# EAGLE design Temp_SMD (EAGLE 8.0.0)
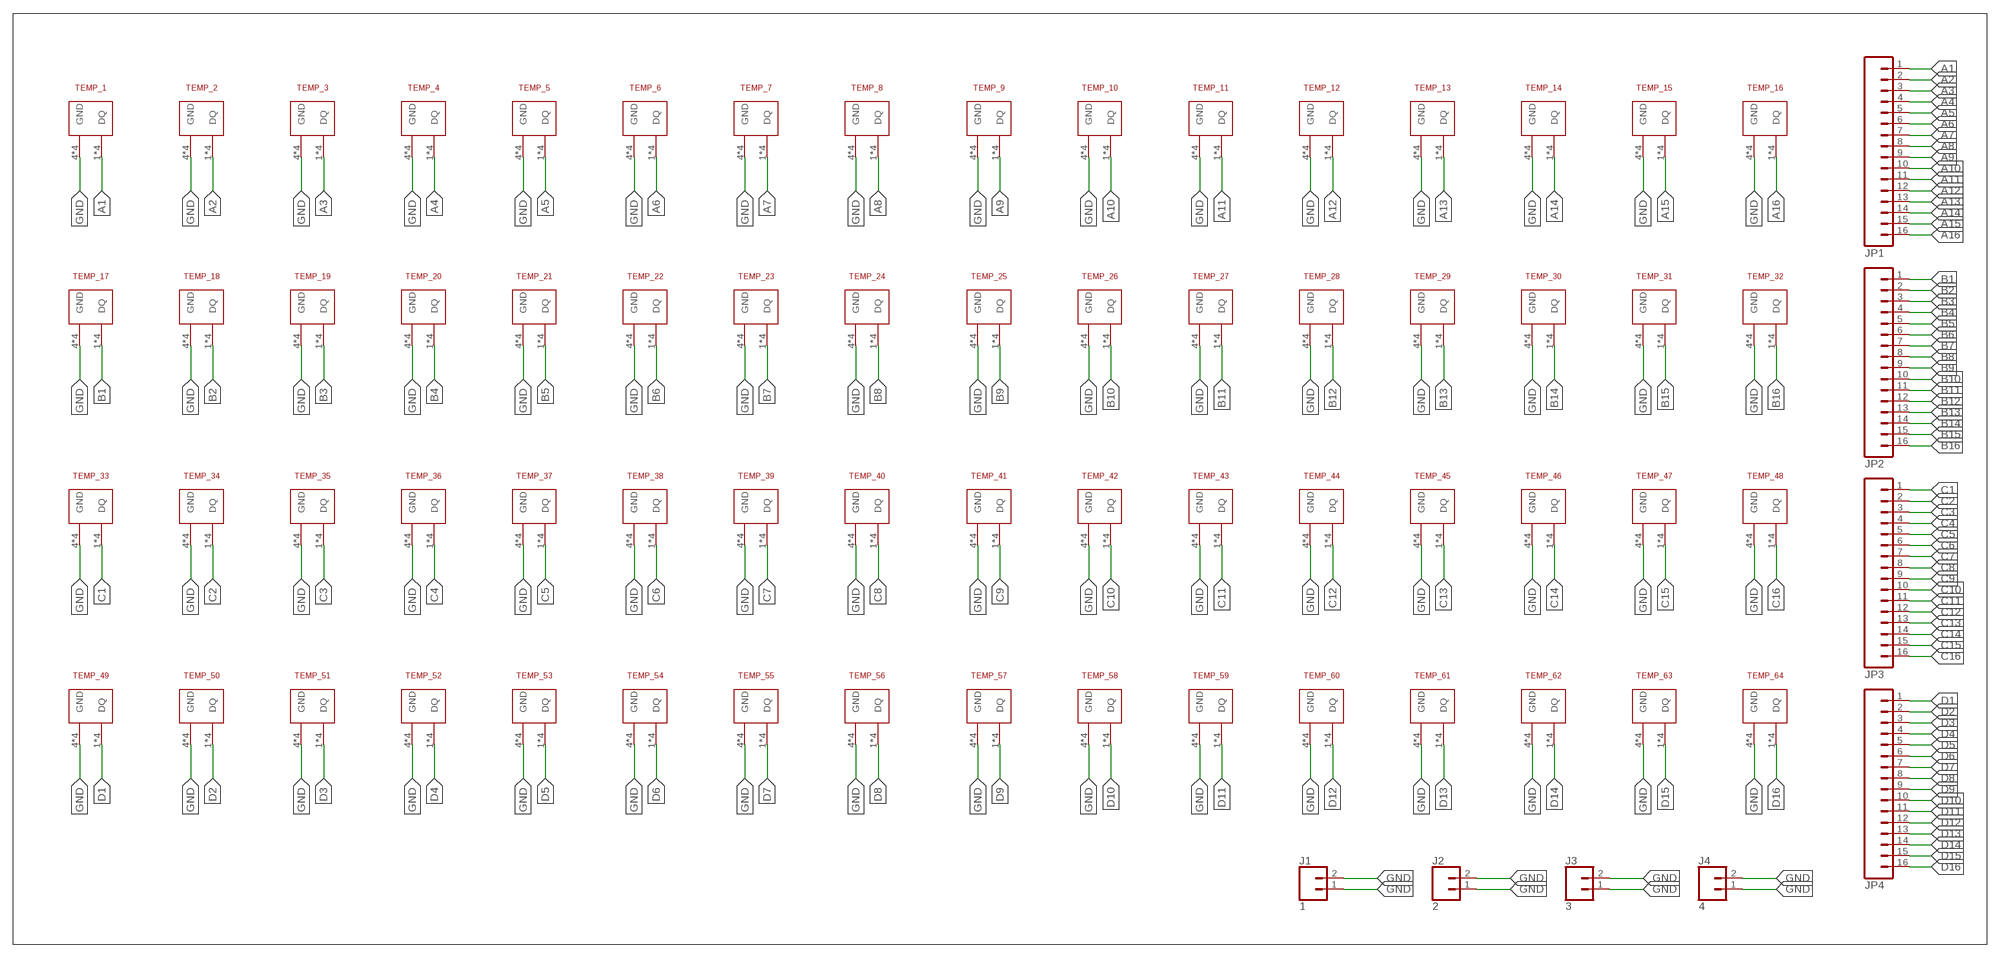
[diagram p0: schematic, sheet 1]

## Parts
J1  1  CONN_02  [1X02]
J2  2  CONN_02  [1X02]
J3  3  CONN_02  [1X02]
J4  4  CONN_02  [1X02]
JP1  M16PTH  [1X16]
JP2  M16PTH  [1X16]
JP3  M16PTH  [1X16]
JP4  M16PTH  [1X16]
TEMP_1  SMD_TEMP  [SMD_TEMP]
TEMP_2  SMD_TEMP  [SMD_TEMP]
TEMP_3  SMD_TEMP  [SMD_TEMP]
TEMP_4  SMD_TEMP  [SMD_TEMP]
TEMP_5  SMD_TEMP  [SMD_TEMP]
TEMP_6  SMD_TEMP  [SMD_TEMP]
TEMP_7  SMD_TEMP  [SMD_TEMP]
TEMP_8  SMD_TEMP  [SMD_TEMP]
TEMP_9  SMD_TEMP  [SMD_TEMP]
TEMP_10  SMD_TEMP  [SMD_TEMP]
TEMP_11  SMD_TEMP  [SMD_TEMP]
TEMP_12  SMD_TEMP  [SMD_TEMP]
TEMP_13  SMD_TEMP  [SMD_TEMP]
TEMP_14  SMD_TEMP  [SMD_TEMP]
TEMP_15  SMD_TEMP  [SMD_TEMP]
TEMP_16  SMD_TEMP  [SMD_TEMP]
TEMP_17  SMD_TEMP  [SMD_TEMP]
TEMP_18  SMD_TEMP  [SMD_TEMP]
TEMP_19  SMD_TEMP  [SMD_TEMP]
TEMP_20  SMD_TEMP  [SMD_TEMP]
TEMP_21  SMD_TEMP  [SMD_TEMP]
TEMP_22  SMD_TEMP  [SMD_TEMP]
TEMP_23  SMD_TEMP  [SMD_TEMP]
TEMP_24  SMD_TEMP  [SMD_TEMP]
TEMP_25  SMD_TEMP  [SMD_TEMP]
TEMP_26  SMD_TEMP  [SMD_TEMP]
TEMP_27  SMD_TEMP  [SMD_TEMP]
TEMP_28  SMD_TEMP  [SMD_TEMP]
TEMP_29  SMD_TEMP  [SMD_TEMP]
TEMP_30  SMD_TEMP  [SMD_TEMP]
TEMP_31  SMD_TEMP  [SMD_TEMP]
TEMP_32  SMD_TEMP  [SMD_TEMP]
TEMP_33  SMD_TEMP  [SMD_TEMP]
TEMP_34  SMD_TEMP  [SMD_TEMP]
TEMP_35  SMD_TEMP  [SMD_TEMP]
TEMP_36  SMD_TEMP  [SMD_TEMP]
TEMP_37  SMD_TEMP  [SMD_TEMP]
TEMP_38  SMD_TEMP  [SMD_TEMP]
TEMP_39  SMD_TEMP  [SMD_TEMP]
TEMP_40  SMD_TEMP  [SMD_TEMP]
TEMP_41  SMD_TEMP  [SMD_TEMP]
TEMP_42  SMD_TEMP  [SMD_TEMP]
TEMP_43  SMD_TEMP  [SMD_TEMP]
TEMP_44  SMD_TEMP  [SMD_TEMP]
TEMP_45  SMD_TEMP  [SMD_TEMP]
TEMP_46  SMD_TEMP  [SMD_TEMP]
TEMP_47  SMD_TEMP  [SMD_TEMP]
TEMP_48  SMD_TEMP  [SMD_TEMP]
TEMP_49  SMD_TEMP  [SMD_TEMP]
TEMP_50  SMD_TEMP  [SMD_TEMP]
TEMP_51  SMD_TEMP  [SMD_TEMP]
TEMP_52  SMD_TEMP  [SMD_TEMP]
TEMP_53  SMD_TEMP  [SMD_TEMP]
TEMP_54  SMD_TEMP  [SMD_TEMP]
TEMP_55  SMD_TEMP  [SMD_TEMP]
TEMP_56  SMD_TEMP  [SMD_TEMP]
TEMP_57  SMD_TEMP  [SMD_TEMP]
TEMP_58  SMD_TEMP  [SMD_TEMP]
TEMP_59  SMD_TEMP  [SMD_TEMP]
TEMP_60  SMD_TEMP  [SMD_TEMP]
TEMP_61  SMD_TEMP  [SMD_TEMP]
TEMP_62  SMD_TEMP  [SMD_TEMP]
TEMP_63  SMD_TEMP  [SMD_TEMP]
TEMP_64  SMD_TEMP  [SMD_TEMP]

## Nets
A1: JP1.1 TEMP_1.1(DQ) TEMP_1.DQ TEMP_1.DQ1(DQ) TEMP_1.DQ2(DQ)
A2: JP1.2 TEMP_2.1(DQ) TEMP_2.DQ TEMP_2.DQ1(DQ) TEMP_2.DQ2(DQ)
A3: JP1.3 TEMP_3.1(DQ) TEMP_3.DQ TEMP_3.DQ1(DQ) TEMP_3.DQ2(DQ)
A4: JP1.4 TEMP_4.1(DQ) TEMP_4.DQ TEMP_4.DQ1(DQ) TEMP_4.DQ2(DQ)
A5: JP1.5 TEMP_5.1(DQ) TEMP_5.DQ TEMP_5.DQ1(DQ) TEMP_5.DQ2(DQ)
A6: JP1.6 TEMP_6.1(DQ) TEMP_6.DQ TEMP_6.DQ1(DQ) TEMP_6.DQ2(DQ)
A7: JP1.7 TEMP_7.1(DQ) TEMP_7.DQ TEMP_7.DQ1(DQ) TEMP_7.DQ2(DQ)
A8: JP1.8 TEMP_8.1(DQ) TEMP_8.DQ TEMP_8.DQ1(DQ) TEMP_8.DQ2(DQ)
A9: JP1.9 TEMP_9.1(DQ) TEMP_9.DQ TEMP_9.DQ1(DQ) TEMP_9.DQ2(DQ)
A10: JP1.10 TEMP_10.1(DQ) TEMP_10.DQ TEMP_10.DQ1(DQ) TEMP_10.DQ2(DQ)
A11: JP1.11 TEMP_11.1(DQ) TEMP_11.DQ TEMP_11.DQ1(DQ) TEMP_11.DQ2(DQ)
A12: JP1.12 TEMP_12.1(DQ) TEMP_12.DQ TEMP_12.DQ1(DQ) TEMP_12.DQ2(DQ)
A13: JP1.13 TEMP_13.1(DQ) TEMP_13.DQ TEMP_13.DQ1(DQ) TEMP_13.DQ2(DQ)
A14: JP1.14 TEMP_14.1(DQ) TEMP_14.DQ TEMP_14.DQ1(DQ) TEMP_14.DQ2(DQ)
A15: JP1.15 TEMP_15.1(DQ) TEMP_15.DQ TEMP_15.DQ1(DQ) TEMP_15.DQ2(DQ)
A16: JP1.16 TEMP_16.1(DQ) TEMP_16.DQ TEMP_16.DQ1(DQ) TEMP_16.DQ2(DQ)
B1: JP2.1 TEMP_17.1(DQ) TEMP_17.DQ TEMP_17.DQ1(DQ) TEMP_17.DQ2(DQ)
B2: JP2.2 TEMP_18.1(DQ) TEMP_18.DQ TEMP_18.DQ1(DQ) TEMP_18.DQ2(DQ)
B3: JP2.3 TEMP_19.1(DQ) TEMP_19.DQ TEMP_19.DQ1(DQ) TEMP_19.DQ2(DQ)
B4: JP2.4 TEMP_20.1(DQ) TEMP_20.DQ TEMP_20.DQ1(DQ) TEMP_20.DQ2(DQ)
B5: JP2.5 TEMP_21.1(DQ) TEMP_21.DQ TEMP_21.DQ1(DQ) TEMP_21.DQ2(DQ)
B6: JP2.6 TEMP_22.1(DQ) TEMP_22.DQ TEMP_22.DQ1(DQ) TEMP_22.DQ2(DQ)
B7: JP2.7 TEMP_23.1(DQ) TEMP_23.DQ TEMP_23.DQ1(DQ) TEMP_23.DQ2(DQ)
B8: JP2.8 TEMP_24.1(DQ) TEMP_24.DQ TEMP_24.DQ1(DQ) TEMP_24.DQ2(DQ)
B9: JP2.9 TEMP_25.1(DQ) TEMP_25.DQ TEMP_25.DQ1(DQ) TEMP_25.DQ2(DQ)
B10: JP2.10 TEMP_26.1(DQ) TEMP_26.DQ TEMP_26.DQ1(DQ) TEMP_26.DQ2(DQ)
B11: JP2.11 TEMP_27.1(DQ) TEMP_27.DQ TEMP_27.DQ1(DQ) TEMP_27.DQ2(DQ)
B12: JP2.12 TEMP_28.1(DQ) TEMP_28.DQ TEMP_28.DQ1(DQ) TEMP_28.DQ2(DQ)
B13: JP2.13 TEMP_29.1(DQ) TEMP_29.DQ TEMP_29.DQ1(DQ) TEMP_29.DQ2(DQ)
B14: JP2.14 TEMP_30.1(DQ) TEMP_30.DQ TEMP_30.DQ1(DQ) TEMP_30.DQ2(DQ)
B15: JP2.15 TEMP_31.1(DQ) TEMP_31.DQ TEMP_31.DQ1(DQ) TEMP_31.DQ2(DQ)
B16: JP2.16 TEMP_32.1(DQ) TEMP_32.DQ TEMP_32.DQ1(DQ) TEMP_32.DQ2(DQ)
C1: JP3.1 TEMP_33.1(DQ) TEMP_33.DQ TEMP_33.DQ1(DQ) TEMP_33.DQ2(DQ)
C2: JP3.2 TEMP_34.1(DQ) TEMP_34.DQ TEMP_34.DQ1(DQ) TEMP_34.DQ2(DQ)
C3: JP3.3 TEMP_35.1(DQ) TEMP_35.DQ TEMP_35.DQ1(DQ) TEMP_35.DQ2(DQ)
C4: JP3.4 TEMP_36.1(DQ) TEMP_36.DQ TEMP_36.DQ1(DQ) TEMP_36.DQ2(DQ)
C5: JP3.5 TEMP_37.1(DQ) TEMP_37.DQ TEMP_37.DQ1(DQ) TEMP_37.DQ2(DQ)
C6: JP3.6 TEMP_38.1(DQ) TEMP_38.DQ TEMP_38.DQ1(DQ) TEMP_38.DQ2(DQ)
C7: JP3.7 TEMP_39.1(DQ) TEMP_39.DQ TEMP_39.DQ1(DQ) TEMP_39.DQ2(DQ)
C8: JP3.8 TEMP_40.1(DQ) TEMP_40.DQ TEMP_40.DQ1(DQ) TEMP_40.DQ2(DQ)
C9: JP3.9 TEMP_41.1(DQ) TEMP_41.DQ TEMP_41.DQ1(DQ) TEMP_41.DQ2(DQ)
C10: JP3.10 TEMP_42.1(DQ) TEMP_42.DQ TEMP_42.DQ1(DQ) TEMP_42.DQ2(DQ)
C11: JP3.11 TEMP_43.1(DQ) TEMP_43.DQ TEMP_43.DQ1(DQ) TEMP_43.DQ2(DQ)
C12: JP3.12 TEMP_44.1(DQ) TEMP_44.DQ TEMP_44.DQ1(DQ) TEMP_44.DQ2(DQ)
C13: JP3.13 TEMP_45.1(DQ) TEMP_45.DQ TEMP_45.DQ1(DQ) TEMP_45.DQ2(DQ)
C14: JP3.14 TEMP_46.1(DQ) TEMP_46.DQ TEMP_46.DQ1(DQ) TEMP_46.DQ2(DQ)
C15: JP3.15 TEMP_47.1(DQ) TEMP_47.DQ TEMP_47.DQ1(DQ) TEMP_47.DQ2(DQ)
C16: JP3.16 TEMP_48.1(DQ) TEMP_48.DQ TEMP_48.DQ1(DQ) TEMP_48.DQ2(DQ)
D1: JP4.1 TEMP_49.1(DQ) TEMP_49.DQ TEMP_49.DQ1(DQ) TEMP_49.DQ2(DQ)
D2: JP4.2 TEMP_50.1(DQ) TEMP_50.DQ TEMP_50.DQ1(DQ) TEMP_50.DQ2(DQ)
D3: JP4.3 TEMP_51.1(DQ) TEMP_51.DQ TEMP_51.DQ1(DQ) TEMP_51.DQ2(DQ)
D4: JP4.4 TEMP_52.1(DQ) TEMP_52.DQ TEMP_52.DQ1(DQ) TEMP_52.DQ2(DQ)
D5: JP4.5 TEMP_53.1(DQ) TEMP_53.DQ TEMP_53.DQ1(DQ) TEMP_53.DQ2(DQ)
D6: JP4.6 TEMP_54.1(DQ) TEMP_54.DQ TEMP_54.DQ1(DQ) TEMP_54.DQ2(DQ)
D7: JP4.7 TEMP_55.1(DQ) TEMP_55.DQ TEMP_55.DQ1(DQ) TEMP_55.DQ2(DQ)
D8: JP4.8 TEMP_56.1(DQ) TEMP_56.DQ TEMP_56.DQ1(DQ) TEMP_56.DQ2(DQ)
D9: JP4.9 TEMP_57.1(DQ) TEMP_57.DQ TEMP_57.DQ1(DQ) TEMP_57.DQ2(DQ)
D10: JP4.10 TEMP_58.1(DQ) TEMP_58.DQ TEMP_58.DQ1(DQ) TEMP_58.DQ2(DQ)
D11: JP4.11 TEMP_59.1(DQ) TEMP_59.DQ TEMP_59.DQ1(DQ) TEMP_59.DQ2(DQ)
D12: JP4.12 TEMP_60.1(DQ) TEMP_60.DQ TEMP_60.DQ1(DQ) TEMP_60.DQ2(DQ)
D13: JP4.13 TEMP_61.1(DQ) TEMP_61.DQ TEMP_61.DQ1(DQ) TEMP_61.DQ2(DQ)
D14: JP4.14 TEMP_62.1(DQ) TEMP_62.DQ TEMP_62.DQ1(DQ) TEMP_62.DQ2(DQ)
D15: JP4.15 TEMP_63.1(DQ) TEMP_63.DQ TEMP_63.DQ1(DQ) TEMP_63.DQ2(DQ)
D16: JP4.16 TEMP_64.1(DQ) TEMP_64.DQ TEMP_64.DQ1(DQ) TEMP_64.DQ2(DQ)
GND: J1.1 J1.2 J2.1 J2.2 J3.1 J3.2 J4.1 J4.2 TEMP_1.4(GND) TEMP_1.8(GND) TEMP_1.GND1(GND) TEMP_1.GND2(GND) TEMP_2.4(GND) TEMP_2.8(GND) TEMP_2.GND1(GND) TEMP_2.GND2(GND) TEMP_3.4(GND) TEMP_3.8(GND) TEMP_3.GND1(GND) TEMP_3.GND2(GND) TEMP_4.4(GND) TEMP_4.8(GND) TEMP_4.GND1(GND) TEMP_4.GND2(GND) TEMP_5.4(GND) TEMP_5.8(GND) TEMP_5.GND1(GND) TEMP_5.GND2(GND) TEMP_6.4(GND) TEMP_6.8(GND) TEMP_6.GND1(GND) TEMP_6.GND2(GND) TEMP_7.4(GND) TEMP_7.8(GND) TEMP_7.GND1(GND) TEMP_7.GND2(GND) TEMP_8.4(GND) TEMP_8.8(GND) TEMP_8.GND1(GND) TEMP_8.GND2(GND) TEMP_9.4(GND) TEMP_9.8(GND) TEMP_9.GND1(GND) TEMP_9.GND2(GND) TEMP_10.4(GND) TEMP_10.8(GND) TEMP_10.GND1(GND) TEMP_10.GND2(GND) TEMP_11.4(GND) TEMP_11.8(GND) TEMP_11.GND1(GND) TEMP_11.GND2(GND) TEMP_12.4(GND) TEMP_12.8(GND) TEMP_12.GND1(GND) TEMP_12.GND2(GND) TEMP_13.4(GND) TEMP_13.8(GND) TEMP_13.GND1(GND) TEMP_13.GND2(GND) TEMP_14.4(GND) TEMP_14.8(GND) TEMP_14.GND1(GND) TEMP_14.GND2(GND) TEMP_15.4(GND) TEMP_15.8(GND) TEMP_15.GND1(GND) TEMP_15.GND2(GND) TEMP_16.4(GND) TEMP_16.8(GND) TEMP_16.GND1(GND) TEMP_16.GND2(GND) TEMP_17.4(GND) TEMP_17.8(GND) TEMP_17.GND1(GND) TEMP_17.GND2(GND) TEMP_18.4(GND) TEMP_18.8(GND) TEMP_18.GND1(GND) TEMP_18.GND2(GND) TEMP_19.4(GND) TEMP_19.8(GND) TEMP_19.GND1(GND) TEMP_19.GND2(GND) TEMP_20.4(GND) TEMP_20.8(GND) TEMP_20.GND1(GND) TEMP_20.GND2(GND) TEMP_21.4(GND) TEMP_21.8(GND) TEMP_21.GND1(GND) TEMP_21.GND2(GND) TEMP_22.4(GND) TEMP_22.8(GND) TEMP_22.GND1(GND) TEMP_22.GND2(GND) TEMP_23.4(GND) TEMP_23.8(GND) TEMP_23.GND1(GND) TEMP_23.GND2(GND) TEMP_24.4(GND) TEMP_24.8(GND) TEMP_24.GND1(GND) TEMP_24.GND2(GND) TEMP_25.4(GND) TEMP_25.8(GND) TEMP_25.GND1(GND) TEMP_25.GND2(GND) TEMP_26.4(GND) TEMP_26.8(GND) TEMP_26.GND1(GND) TEMP_26.GND2(GND) TEMP_27.4(GND) TEMP_27.8(GND) TEMP_27.GND1(GND) TEMP_27.GND2(GND) TEMP_28.4(GND) TEMP_28.8(GND) TEMP_28.GND1(GND) TEMP_28.GND2(GND) TEMP_29.4(GND) TEMP_29.8(GND) TEMP_29.GND1(GND) TEMP_29.GND2(GND) TEMP_30.4(GND) TEMP_30.8(GND) TEMP_30.GND1(GND) TEMP_30.GND2(GND) TEMP_31.4(GND) TEMP_31.8(GND) TEMP_31.GND1(GND) TEMP_31.GND2(GND) TEMP_32.4(GND) TEMP_32.8(GND) TEMP_32.GND1(GND) TEMP_32.GND2(GND) TEMP_33.4(GND) TEMP_33.8(GND) TEMP_33.GND1(GND) TEMP_33.GND2(GND) TEMP_34.4(GND) TEMP_34.8(GND) TEMP_34.GND1(GND) TEMP_34.GND2(GND) TEMP_35.4(GND) TEMP_35.8(GND) TEMP_35.GND1(GND) TEMP_35.GND2(GND) TEMP_36.4(GND) TEMP_36.8(GND) TEMP_36.GND1(GND) TEMP_36.GND2(GND) TEMP_37.4(GND) TEMP_37.8(GND) TEMP_37.GND1(GND) TEMP_37.GND2(GND) TEMP_38.4(GND) TEMP_38.8(GND) TEMP_38.GND1(GND) TEMP_38.GND2(GND) TEMP_39.4(GND) TEMP_39.8(GND) TEMP_39.GND1(GND) TEMP_39.GND2(GND) TEMP_40.4(GND) TEMP_40.8(GND) TEMP_40.GND1(GND) TEMP_40.GND2(GND) TEMP_41.4(GND) TEMP_41.8(GND) TEMP_41.GND1(GND) TEMP_41.GND2(GND) TEMP_42.4(GND) TEMP_42.8(GND) TEMP_42.GND1(GND) TEMP_42.GND2(GND) TEMP_43.4(GND) TEMP_43.8(GND) TEMP_43.GND1(GND) TEMP_43.GND2(GND) TEMP_44.4(GND) TEMP_44.8(GND) TEMP_44.GND1(GND) TEMP_44.GND2(GND) TEMP_45.4(GND) TEMP_45.8(GND) TEMP_45.GND1(GND) TEMP_45.GND2(GND) TEMP_46.4(GND) TEMP_46.8(GND) TEMP_46.GND1(GND) TEMP_46.GND2(GND) TEMP_47.4(GND) TEMP_47.8(GND) TEMP_47.GND1(GND) TEMP_47.GND2(GND) TEMP_48.4(GND) TEMP_48.8(GND) TEMP_48.GND1(GND) TEMP_48.GND2(GND) TEMP_49.4(GND) TEMP_49.8(GND) TEMP_49.GND1(GND) TEMP_49.GND2(GND) TEMP_50.4(GND) TEMP_50.8(GND) TEMP_50.GND1(GND) TEMP_50.GND2(GND) TEMP_51.4(GND) TEMP_51.8(GND) TEMP_51.GND1(GND) TEMP_51.GND2(GND) TEMP_52.4(GND) TEMP_52.8(GND) TEMP_52.GND1(GND) TEMP_52.GND2(GND) TEMP_53.4(GND) TEMP_53.8(GND) TEMP_53.GND1(GND) TEMP_53.GND2(GND) TEMP_54.4(GND) TEMP_54.8(GND) TEMP_54.GND1(GND) TEMP_54.GND2(GND) TEMP_55.4(GND) TEMP_55.8(GND) TEMP_55.GND1(GND) TEMP_55.GND2(GND) TEMP_56.4(GND) TEMP_56.8(GND) TEMP_56.GND1(GND) TEMP_56.GND2(GND) TEMP_57.4(GND) TEMP_57.8(GND) TEMP_57.GND1(GND) TEMP_57.GND2(GND) TEMP_58.4(GND) TEMP_58.8(GND) TEMP_58.GND1(GND) TEMP_58.GND2(GND) TEMP_59.4(GND) TEMP_59.8(GND) TEMP_59.GND1(GND) TEMP_59.GND2(GND) TEMP_60.4(GND) TEMP_60.8(GND) TEMP_60.GND1(GND) TEMP_60.GND2(GND) TEMP_61.4(GND) TEMP_61.8(GND) TEMP_61.GND1(GND) TEMP_61.GND2(GND) TEMP_62.4(GND) TEMP_62.8(GND) TEMP_62.GND1(GND) TEMP_62.GND2(GND) TEMP_63.4(GND) TEMP_63.8(GND) TEMP_63.GND1(GND) TEMP_63.GND2(GND) TEMP_64.4(GND) TEMP_64.8(GND) TEMP_64.GND1(GND) TEMP_64.GND2(GND)

## Library data of the parts
J1-J4 = SparkFun-Connectors:CONN_02: Multi connection point. Often used as Generic Header-pin footprint for 0.1 inch spaced/style header connections On any of the 0.1 inch spaced packages, you can populate with these: Break Away Headers - Straight <https://www.sparkfun.com/products/116> (PRT-00116) Break Away Male Headers - Right Angle <https://www.sparkfun.com/products/553> (PRT-00553) Female Headers <https://www.sparkfun.com/products/115> (PRT-00115) Break Away Headers - Machine Pin <https://www.sparkfun.com/products/117> (PRT-00117) Break Away Female Headers - Swiss Machine Pin <https://www.sparkfun.com/products/743> (PRT-00743) For SCREWTERMINALS and SPRING TERMINALS visit here: Screw Terimnals on SparkFun.com <https://www.sparkfun.com/search/results?term=Screw+Terminals> (5mm/3.5mm/2.54mm spacing) This device is also useful as a general connection point to wire up your design to another part of your project. Our various solder wires solder well into these plated through hole pads. Hook-Up Wire - Assortment (Stranded, 22 AWG) <https://www.sparkfun.com/products/11375> (PRT-11375) Hook-Up Wire - Assortment (Solid Core, 22 AWG) <https://www.sparkfun.com/products/11367> (PRT-11367) View the entire wire category on our website here <https://www.sparkfun.com/categories/141> Special notes: Molex polarized connector foot print use with: PRT-08233 with associated crimp pins and housings. 2.54_SCREWTERM for use with PRT-10571. 3.5mm Screw Terminal footprints for PRT-08084 5mm Screw Terminal footprints for use with PRT-08432
JP1-JP4 = SparkFun-Connectors:M16: 1x16 .1" header
TEMP_1-TEMP_64 = UIO-John:SMD_TEMP

## Board
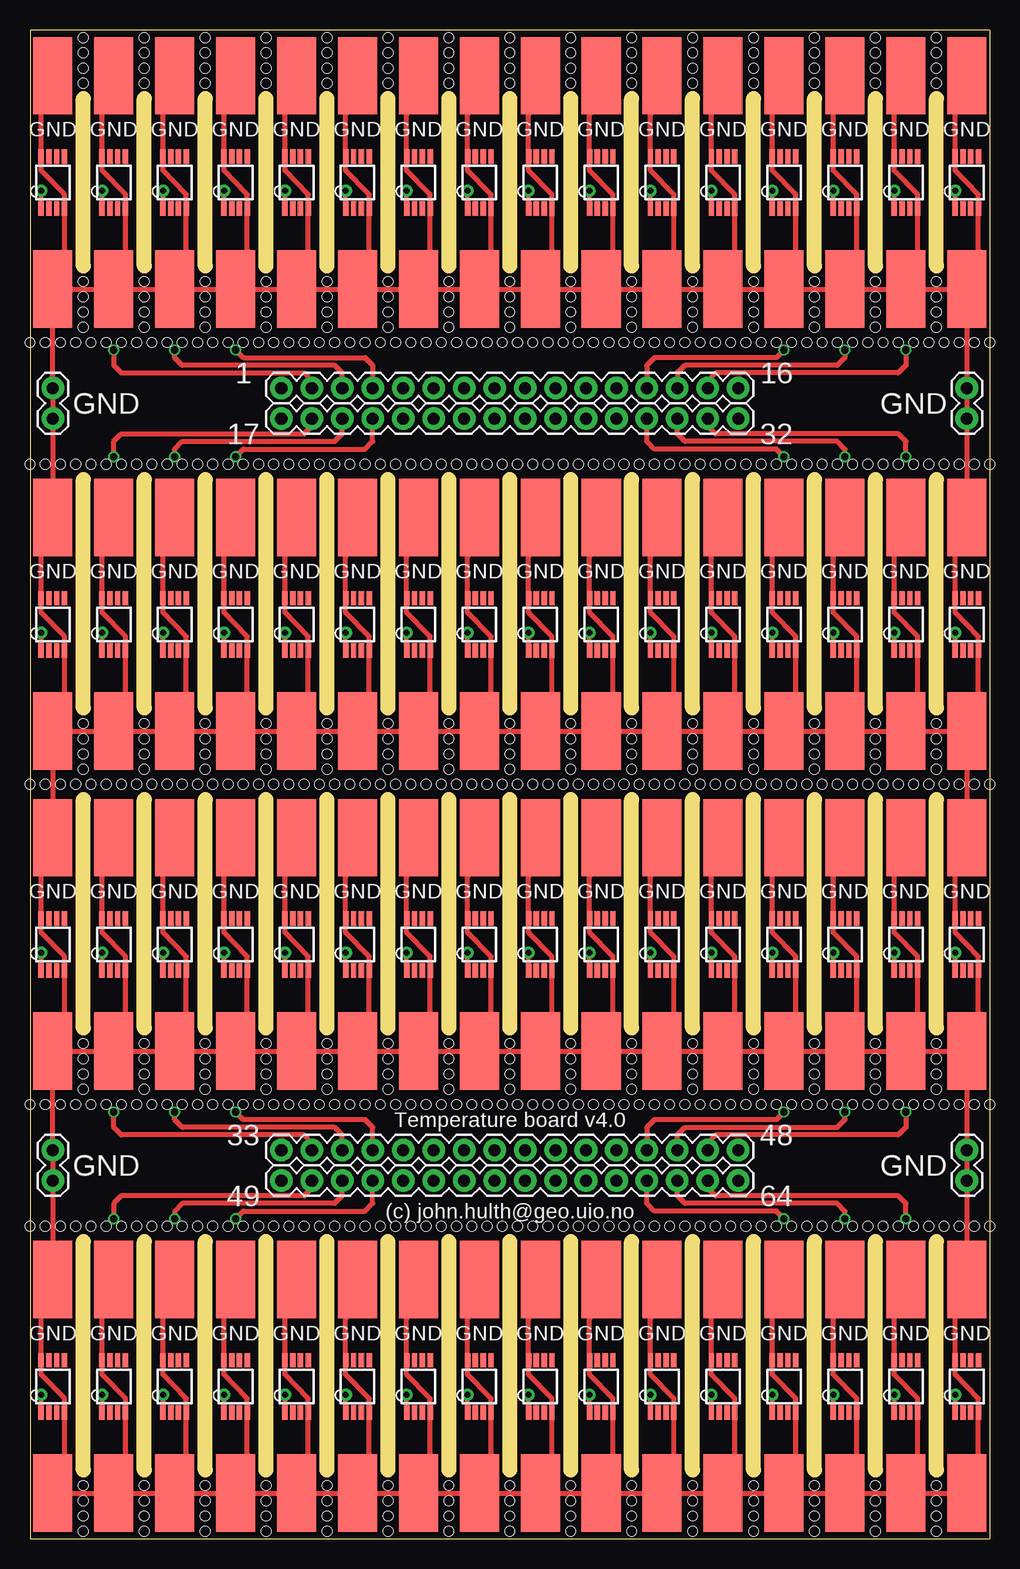
[diagram p1: board, top side]
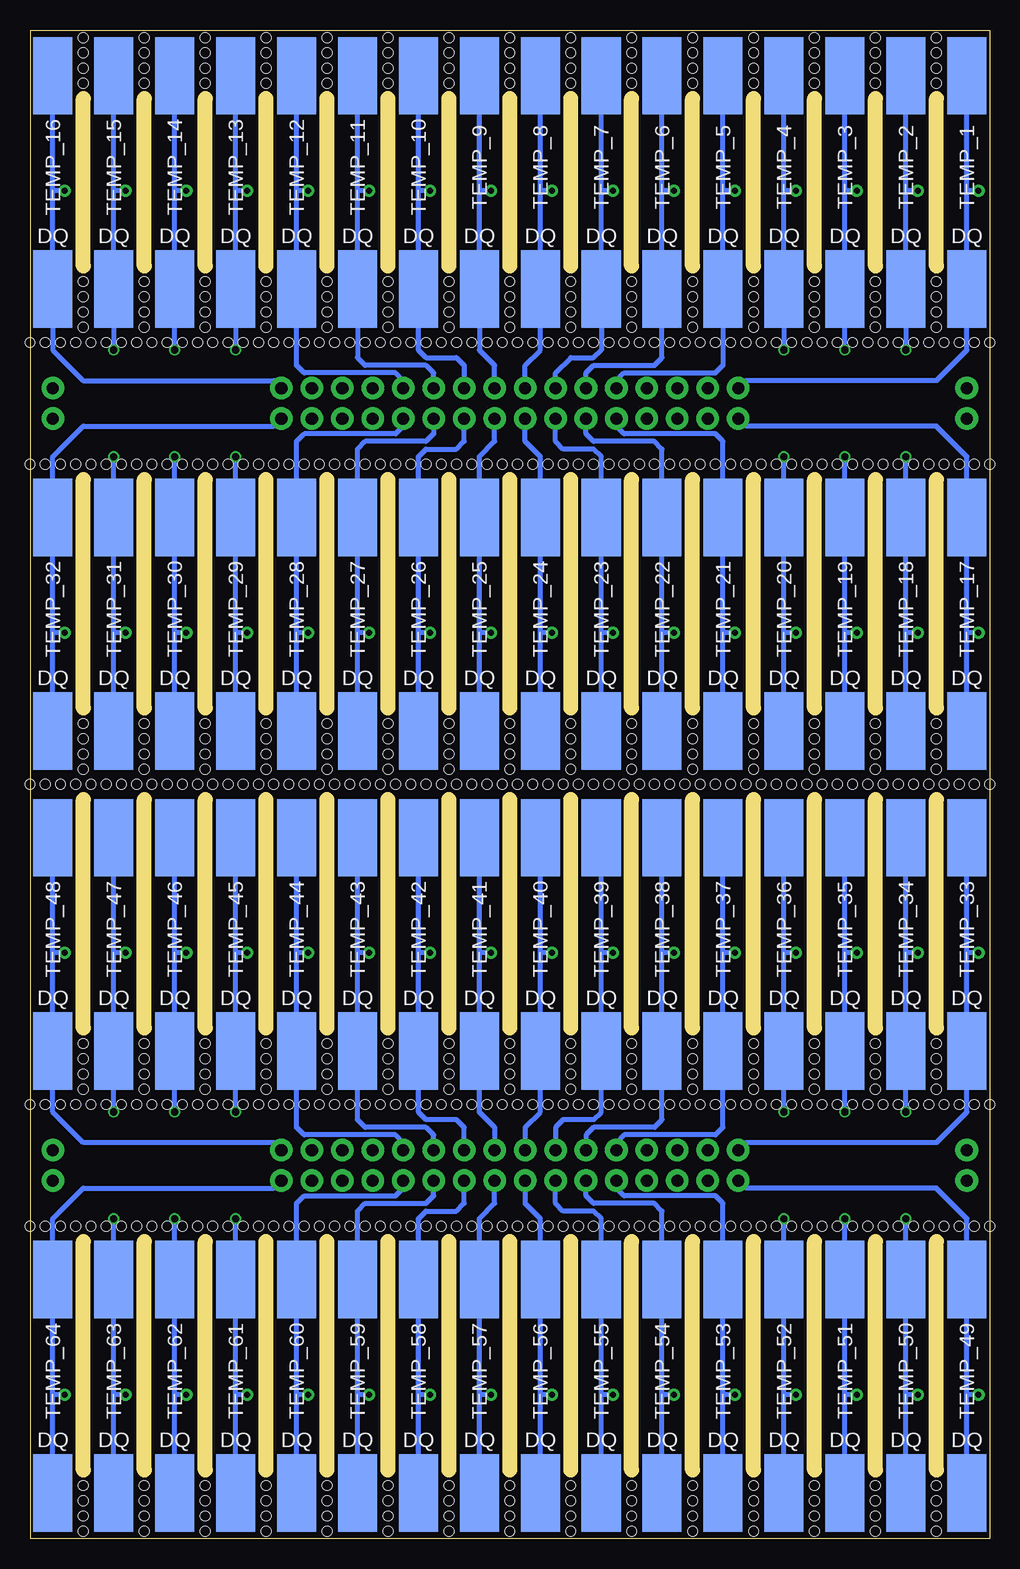
[diagram p2: board, bottom side, seen from below]

Size 80.01 x 125.73 mm. Coordinates in mm from the lower left corner, seen from the top.
Outline: 0,0 80.01,0 80.01,125.73 0,125.73 0,0
Copper layers (1*16): Top 0.035mm / dielectric 1.5mm / Bottom 0.035mm
Design rules "dirt_cheap_dirty_boards.v1": minimum track width 5mil, minimum drill 12mil, track to track 5mil, track to pad 5mil, pad to pad 5mil, via to via 5mil, smd to smd 0mil, copper to edge 10mil, drill to drill 10mil, minimum pad ring 10mil, minimum via ring 6mil, stop-mask expansion 2mil, vias tented up to drill 25mil, thermal gap 10mil
Holes 0.8 mm at 4.45,66.67 4.45,67.94 4.45,65.41 4.45,64.14 2.54,89.53 1.27,89.53 3.81,89.53 0,89.53 9.53,66.67 9.53,67.94 9.53,65.41 9.53,64.14 14.61,66.67 14.61,67.94 14.61,65.41 14.61,64.14 19.68,66.67 19.68,67.94 19.68,65.41 19.68,64.14 24.77,66.67 24.77,67.94 24.77,65.41 24.77,64.14 29.84,66.67 29.84,67.94 29.84,65.41 29.84,64.14 34.92,66.67 34.92,67.94 34.92,65.41 34.92,64.14 40.01,66.67 40.01,67.94 40.01,65.41 40.01,64.14 45.09,66.67 45.09,67.94 45.09,65.41 45.09,64.14 50.16,66.67 50.16,67.94 50.16,65.41 50.16,64.14 55.24,66.67 55.24,67.94 55.24,65.41 55.24,64.14 60.33,66.67 60.33,67.94 60.33,65.41 60.33,64.14 65.41,66.67 65.41,67.94 65.41,65.41 65.41,64.14 70.48,66.67 70.48,67.94 70.48,65.41 70.48,64.14 75.56,66.67 75.56,67.94 75.56,65.41 75.56,64.14 7.62,89.53 6.35,89.53 8.89,89.53 5.08,89.53 12.7,89.53 11.43,89.53 13.97,89.53 10.16,89.53 17.78,89.53 16.51,89.53 19.05,89.53 15.24,89.53 22.86,89.53 21.59,89.53 24.13,89.53 20.32,89.53 27.94,89.53 26.67,89.53 29.21,89.53 25.4,89.53 33.02,89.53 31.75,89.53 34.29,89.53 30.48,89.53 38.1,89.53 36.83,89.53 39.37,89.53 35.56,89.53 43.18,89.53 41.91,89.53 44.45,89.53 40.64,89.53 48.26,89.53 46.99,89.53 49.53,89.53 45.72,89.53 53.34,89.53 52.07,89.53 54.61,89.53 50.8,89.53 58.42,89.53 57.15,89.53 59.69,89.53 55.88,89.53 63.5,89.53 62.23,89.53 64.77,89.53 60.96,89.53 68.58,89.53 67.31,89.53 69.85,89.53 66.04,89.53 73.66,89.53 72.39,89.53 74.93,89.53 71.12,89.53 78.74,89.53 77.47,89.53 80.01,89.53 76.2,89.53 4.45,103.5 4.45,104.78 4.45,102.23 4.45,100.97 2.54,99.69 1.27,99.69 3.81,99.69 0,99.69 9.53,103.5 9.53,104.78 9.53,102.23 9.53,100.97 7.62,99.69 6.35,99.69 8.89,99.69 5.08,99.69 14.61,103.5 14.61,104.78 14.61,102.23 14.61,100.97 12.7,99.69 11.43,99.69 13.97,99.69 10.16,99.69 19.68,103.5 19.68,104.78 19.68,102.23 19.68,100.97 17.78,99.69 16.51,99.69 19.05,99.69 15.24,99.69 24.77,103.5 24.77,104.78 24.77,102.23 24.77,100.97 22.86,99.69 21.59,99.69 24.13,99.69 20.32,99.69 29.84,103.5 29.84,104.78 29.84,102.23 29.84,100.97 27.94,99.69 26.67,99.69 29.21,99.69 25.4,99.69 34.92,103.5 34.92,104.78 34.92,102.23 34.92,100.97 33.02,99.69 31.75,99.69 34.29,99.69 30.48,99.69 40.01,103.5 40.01,104.78 40.01,102.23 40.01,100.97 38.1,99.69 36.83,99.69 39.37,99.69 35.56,99.69 45.09,103.5 45.09,104.78 45.09,102.23 45.09,100.97 43.18,99.69 41.91,99.69 44.45,99.69 40.64,99.69 50.16,103.5 50.16,104.78 50.16,102.23 50.16,100.97 48.26,99.69 46.99,99.69 49.53,99.69 45.72,99.69 55.24,103.5 55.24,104.78 55.24,102.23 55.24,100.97 53.34,99.69 52.07,99.69 54.61,99.69 50.8,99.69 60.33,103.5 60.33,104.78 60.33,102.23 60.33,100.97 58.42,99.69 57.15,99.69 59.69,99.69 55.88,99.69 65.41,103.5 65.41,104.78 65.41,102.23 65.41,100.97 63.5,99.69 62.23,99.69 64.77,99.69 60.96,99.69 70.48,103.5 70.48,104.78 70.48,102.23 70.48,100.97 68.58,99.69 67.31,99.69 69.85,99.69 66.04,99.69 75.56,103.5 75.56,104.78 75.56,102.23 75.56,100.97 73.66,99.69 72.39,99.69 74.93,99.69 71.12,99.69 78.74,99.69 77.47,99.69 80.01,99.69 76.2,99.69 4.45,123.83 4.45,125.09 4.45,122.56 4.45,121.28 9.53,123.83 9.53,125.09 9.53,122.56 9.53,121.28 14.61,123.83 14.61,125.09 14.61,122.56 14.61,121.28 19.68,123.83 19.68,125.09 19.68,122.56 19.68,121.28 24.77,123.83 24.77,125.09 24.77,122.56 24.77,121.28 29.84,123.83 29.84,125.09 29.84,122.56 29.84,121.28 34.92,123.83 34.92,125.09 34.92,122.56 34.92,121.28 40.01,123.83 40.01,125.09 40.01,122.56 40.01,121.28 45.09,123.83 45.09,125.09 45.09,122.56 45.09,121.28 50.16,123.83 50.16,125.09 50.16,122.56 50.16,121.28 55.24,123.83 55.24,125.09 55.24,122.56 55.24,121.28 60.33,123.83 60.33,125.09 60.33,122.56 60.33,121.28 65.41,123.83 65.41,125.09 65.41,122.56 65.41,121.28 70.48,123.83 70.48,125.09 70.48,122.56 70.48,121.28 75.56,123.83 75.56,125.09 75.56,122.56 75.56,121.28 4.45,40.01 4.45,41.27 4.45,38.73 4.45,37.47 2.54,62.87 1.27,62.87 3.81,62.87 0,62.87 9.53,40.01 9.53,41.27 9.53,38.73 9.53,37.47 14.61,40.01 14.61,41.27 14.61,38.73 14.61,37.47 19.68,40.01 19.68,41.27 19.68,38.73 19.68,37.47 24.77,40.01 24.77,41.27 24.77,38.73 24.77,37.47 29.84,40.01 29.84,41.27 29.84,38.73 29.84,37.47 34.92,40.01 34.92,41.27 34.92,38.73 34.92,37.47 40.01,40.01 40.01,41.27 40.01,38.73 40.01,37.47 45.09,40.01 45.09,41.27 45.09,38.73 45.09,37.47 50.16,40.01 50.16,41.27 50.16,38.73 50.16,37.47 55.24,40.01 55.24,41.27 55.24,38.73 55.24,37.47 60.33,40.01 60.33,41.27 60.33,38.73 60.33,37.47 65.41,40.01 65.41,41.27 65.41,38.73 65.41,37.47 70.48,40.01 70.48,41.27 70.48,38.73 70.48,37.47 75.56,40.01 75.56,41.27 75.56,38.73 75.56,37.47 7.62,62.87 6.35,62.87 8.89,62.87 5.08,62.87 12.7,62.87 11.43,62.87 13.97,62.87 10.16,62.87 17.78,62.87 16.51,62.87 19.05,62.87 15.24,62.87 22.86,62.87 21.59,62.87 24.13,62.87 20.32,62.87 27.94,62.87 26.67,62.87 29.21,62.87 25.4,62.87 33.02,62.87 31.75,62.87 34.29,62.87 30.48,62.87 38.1,62.87 36.83,62.87 39.37,62.87 35.56,62.87 43.18,62.87 41.91,62.87 44.45,62.87 40.64,62.87 48.26,62.87 46.99,62.87 49.53,62.87 45.72,62.87 53.34,62.87 52.07,62.87 54.61,62.87 50.8,62.87 58.42,62.87 57.15,62.87 59.69,62.87 55.88,62.87 63.5,62.87 62.23,62.87 64.77,62.87 60.96,62.87 68.58,62.87 67.31,62.87 69.85,62.87 66.04,62.87 73.66,62.87 72.39,62.87 74.93,62.87 71.12,62.87 78.74,62.87 77.47,62.87 80.01,62.87 76.2,62.87 2.54,36.2 1.27,36.2 3.81,36.2 0,36.2 7.62,36.2 6.35,36.2 8.89,36.2 5.08,36.2 12.7,36.2 11.43,36.2 13.97,36.2 10.16,36.2 17.78,36.2 16.51,36.2 19.05,36.2 15.24,36.2 22.86,36.2 21.59,36.2 24.13,36.2 20.32,36.2 27.94,36.2 26.67,36.2 29.21,36.2 25.4,36.2 33.02,36.2 31.75,36.2 34.29,36.2 30.48,36.2 38.1,36.2 36.83,36.2 39.37,36.2 35.56,36.2 43.18,36.2 41.91,36.2 44.45,36.2 40.64,36.2 48.26,36.2 46.99,36.2 49.53,36.2 45.72,36.2 53.34,36.2 52.07,36.2 54.61,36.2 50.8,36.2 58.42,36.2 57.15,36.2 59.69,36.2 55.88,36.2 63.5,36.2 62.23,36.2 64.77,36.2 60.96,36.2 68.58,36.2 67.31,36.2 69.85,36.2 66.04,36.2 73.66,36.2 72.39,36.2 74.93,36.2 71.12,36.2 78.74,36.2 77.47,36.2 80.01,36.2 76.2,36.2 4.45,3.17 4.45,4.45 4.45,1.91 4.45,0.64 2.54,26.04 1.27,26.04 3.81,26.04 0,26.04 9.53,3.17 9.53,4.45 9.53,1.91 9.53,0.64 14.61,3.17 14.61,4.45 14.61,1.91 14.61,0.64 19.68,3.17 19.68,4.45 19.68,1.91 19.68,0.64 24.77,3.17 24.77,4.45 24.77,1.91 24.77,0.64 29.84,3.17 29.84,4.45 29.84,1.91 29.84,0.64 34.92,3.17 34.92,4.45 34.92,1.91 34.92,0.64 40.01,3.17 40.01,4.45 40.01,1.91 40.01,0.64 45.09,3.17 45.09,4.45 45.09,1.91 45.09,0.64 50.16,3.17 50.16,4.45 50.16,1.91 50.16,0.64 55.24,3.17 55.24,4.45 55.24,1.91 55.24,0.64 60.33,3.17 60.33,4.45 60.33,1.91 60.33,0.64 65.41,3.17 65.41,4.45 65.41,1.91 65.41,0.64 70.48,3.17 70.48,4.45 70.48,1.91 70.48,0.64 75.56,3.17 75.56,4.45 75.56,1.91 75.56,0.64 7.62,26.04 6.35,26.04 8.89,26.04 5.08,26.04 12.7,26.04 11.43,26.04 13.97,26.04 10.16,26.04 17.78,26.04 16.51,26.04 19.05,26.04 15.24,26.04 22.86,26.04 21.59,26.04 24.13,26.04 20.32,26.04 27.94,26.04 26.67,26.04 29.21,26.04 25.4,26.04 33.02,26.04 31.75,26.04 34.29,26.04 30.48,26.04 38.1,26.04 36.83,26.04 39.37,26.04 35.56,26.04 43.18,26.04 41.91,26.04 44.45,26.04 40.64,26.04 48.26,26.04 46.99,26.04 49.53,26.04 45.72,26.04 53.34,26.04 52.07,26.04 54.61,26.04 50.8,26.04 58.42,26.04 57.15,26.04 59.69,26.04 55.88,26.04 63.5,26.04 62.23,26.04 64.77,26.04 60.96,26.04 68.58,26.04 67.31,26.04 69.85,26.04 66.04,26.04 73.66,26.04 72.39,26.04 74.93,26.04 71.12,26.04 78.74,26.04 77.47,26.04 80.01,26.04 76.2,26.04
Milling: 60 lines

### Footprints (pad centres in the part's own frame; a part is rotated, then mirrored left to right if it is on the bottom)
1X02 = drill 1.016 pad 1.88: 1 0,0; 2 2.54,0
1X16 = drill 1.016 pad 1.88: 1 0,0; 2 2.54,0; 3 5.08,0; 4 7.62,0; 5 10.16,0; 6 12.7,0; 7 15.24,0; 8 17.78,0; 9 20.32,0; 10 22.86,0; 11 25.4,0; 12 27.94,0; 13 30.48,0; 14 33.02,0; 15 35.56,0; 16 38.1,0
SMD_TEMP = smd 0.45 x 1.2: 1 -0.975,-2.175; 2 -0.325,-2.175; 3 0.325,-2.175; 4 0.975,-2.175; 5 0.975,2.175; 6 0.325,2.175; 7 -0.325,2.175; 8 -0.975,2.175 | drill 0.5: DQ -0.975,-0.7 | smd 3.251 x 6.452 bottom: DQ1 0,-8.89; DQ2 0,8.89 | smd 3.251 x 6.452: GND1 0,-8.89; GND2 0,8.89

### Placement (x,y rotation side)
J1  1.91,93.34 90 top
J2  78.11,93.34 90 top
J3  1.91,29.84 90 top
J4  78.11,29.84 90 top
JP1  20.95,95.89 0 top
JP2  20.95,93.34 0 top
JP3  20.95,32.38 0 top
JP4  20.95,29.84 0 top
TEMP_1  1.91,113.03 0 top
TEMP_2  6.99,113.03 0 top
TEMP_3  12.06,113.03 0 top
TEMP_4  17.14,113.03 0 top
TEMP_5  22.23,113.03 0 top
TEMP_6  27.3,113.03 0 top
TEMP_7  32.38,113.03 0 top
TEMP_8  37.47,113.03 0 top
TEMP_9  42.55,113.03 0 top
TEMP_10  47.62,113.03 0 top
TEMP_11  52.7,113.03 0 top
TEMP_12  57.78,113.03 0 top
TEMP_13  62.87,113.03 0 top
TEMP_14  67.94,113.03 0 top
TEMP_15  73.03,113.03 0 top
TEMP_16  78.11,113.03 0 top
TEMP_17  1.91,76.2 0 top
TEMP_18  6.99,76.2 0 top
TEMP_19  12.06,76.2 0 top
TEMP_20  17.14,76.2 0 top
TEMP_21  22.23,76.2 0 top
TEMP_22  27.3,76.2 0 top
TEMP_23  32.38,76.2 0 top
TEMP_24  37.47,76.2 0 top
TEMP_25  42.55,76.2 0 top
TEMP_26  47.62,76.2 0 top
TEMP_27  52.7,76.2 0 top
TEMP_28  57.78,76.2 0 top
TEMP_29  62.87,76.2 0 top
TEMP_30  67.94,76.2 0 top
TEMP_31  73.03,76.2 0 top
TEMP_32  78.11,76.2 0 top
TEMP_33  1.91,49.53 0 top
TEMP_34  6.99,49.53 0 top
TEMP_35  12.06,49.53 0 top
TEMP_36  17.14,49.53 0 top
TEMP_37  22.23,49.53 0 top
TEMP_38  27.3,49.53 0 top
TEMP_39  32.38,49.53 0 top
TEMP_40  37.47,49.53 0 top
TEMP_41  42.55,49.53 0 top
TEMP_42  47.62,49.53 0 top
TEMP_43  52.7,49.53 0 top
TEMP_44  57.78,49.53 0 top
TEMP_45  62.87,49.53 0 top
TEMP_46  67.94,49.53 0 top
TEMP_47  73.03,49.53 0 top
TEMP_48  78.11,49.53 0 top
TEMP_49  1.91,12.7 0 top
TEMP_50  6.99,12.7 0 top
TEMP_51  12.06,12.7 0 top
TEMP_52  17.14,12.7 0 top
TEMP_53  22.23,12.7 0 top
TEMP_54  27.3,12.7 0 top
TEMP_55  32.38,12.7 0 top
TEMP_56  37.47,12.7 0 top
TEMP_57  42.55,12.7 0 top
TEMP_58  47.62,12.7 0 top
TEMP_59  52.7,12.7 0 top
TEMP_60  57.78,12.7 0 top
TEMP_61  62.87,12.7 0 top
TEMP_62  67.94,12.7 0 top
TEMP_63  73.03,12.7 0 top
TEMP_64  78.11,12.7 0 top

### Tracks (layer width: path | path; a pad name or v marks a point on that pad's centre or on a via)
A1
  Bottom 0.406: JP1.1 20.32,96.52 4.45,96.52 1.91,99.06 TEMP_1.DQ1
A2  (via drill 0.6)
  Top 0.406: v6.99,99.06 6.99,97.79 7.62,97.16 22.86,97.16 23.5,96.52 JP1.2
  Bottom 0.406: TEMP_2.DQ1 v6.99,99.06
A3  (via drill 0.6)
  Top 0.406: JP1.3 26.04,97.16 25.4,97.79 12.7,97.79 12.06,98.42 v12.06,99.06
  Bottom 0.406: v12.06,99.06 TEMP_3.DQ1
A4  (via drill 0.6)
  Top 0.406: v17.14,99.06 17.78,98.42 27.94,98.42 28.57,97.79 JP1.4
  Bottom 0.406: TEMP_4.DQ1 v17.14,99.06
A5
  Bottom 0.406: JP1.5 31.11,96.52 30.48,97.16 22.86,97.16 22.23,97.79 TEMP_5.DQ1
A6
  Bottom 0.406: JP1.6 33.66,97.16 33.02,97.79 27.94,97.79 27.3,98.42 TEMP_6.DQ1
A7
  Bottom 0.406: JP1.7 36.2,97.16 34.92,98.42 33.02,98.42 32.38,99.06 TEMP_7.DQ1
A8
  Bottom 0.406: JP1.8 38.73,97.79 37.47,99.06 TEMP_8.DQ1
A9
  Bottom 0.406: JP1.9 41.27,97.79 42.55,99.06 TEMP_9.DQ1
A10
  Bottom 0.406: JP1.10 43.81,97.79 44.45,98.42 46.99,98.42 47.62,99.06 TEMP_10.DQ1
A11
  Bottom 0.406: JP1.11 46.35,97.16 46.99,97.79 52.07,97.79 52.7,98.42 TEMP_11.DQ1
A12
  Bottom 0.406: JP1.12 48.9,96.52 49.53,97.16 57.15,97.16 57.78,97.79 TEMP_12.DQ1
A13  (via drill 0.6)
  Top 0.406: v62.87,99.06 62.23,98.42 52.07,98.42 51.44,97.79 JP1.13
  Bottom 0.406: TEMP_13.DQ1 v62.87,99.06
A14  (via drill 0.6)
  Top 0.406: v67.94,99.06 67.94,98.42 67.31,97.79 54.61,97.79 53.98,97.16 JP1.14
  Bottom 0.406: v67.94,99.06 TEMP_14.DQ1
A15  (via drill 0.6)
  Top 0.406: v73.03,99.06 73.03,97.79 72.39,97.16 57.15,97.16 56.52,96.52 JP1.15
  Bottom 0.406: TEMP_15.DQ1 v73.03,99.06
A16
  Bottom 0.406: JP1.16 59.69,96.52 75.56,96.52 78.11,99.06 TEMP_16.DQ1
B1
  Bottom 0.406: JP2.1 20.32,92.71 4.45,92.71 1.91,90.17 TEMP_17.DQ2
B2  (via drill 0.6)
  Top 0.406: v6.99,90.17 6.99,91.44 7.62,92.08 22.86,92.08 23.5,92.71 JP2.2
  Bottom 0.406: TEMP_18.DQ2 v6.99,90.17
B3  (via drill 0.6)
  Top 0.406: v12.06,90.17 12.06,90.81 12.7,91.44 25.4,91.44 26.04,92.08 JP2.3
  Bottom 0.406: TEMP_19.DQ2 v12.06,90.17
B4  (via drill 0.6)
  Top 0.406: v17.14,90.17 17.78,90.81 27.94,90.81 28.57,91.44 JP2.4
  Bottom 0.406: TEMP_20.DQ2 v17.14,90.17
B5
  Bottom 0.406: JP2.5 31.11,92.71 30.48,92.08 22.86,92.08 22.23,91.44 TEMP_21.DQ2
B6
  Bottom 0.406: JP2.6 33.66,92.08 33.02,91.44 27.94,91.44 27.3,90.81 TEMP_22.DQ2
B7
  Bottom 0.406: JP2.7 36.2,91.44 35.56,90.81 33.02,90.81 32.38,90.17 TEMP_23.DQ2
B8
  Bottom 0.406: JP2.8 38.73,91.44 37.47,90.17 TEMP_24.DQ2
B9
  Bottom 0.406: JP2.9 41.27,91.44 42.55,90.17 TEMP_25.DQ2
B10
  Bottom 0.406: JP2.10 43.81,91.44 44.45,90.81 46.99,90.81 47.62,90.17 TEMP_26.DQ2
B11
  Bottom 0.406: JP2.11 46.35,92.08 46.99,91.44 52.07,91.44 52.7,90.81 TEMP_27.DQ2
B12
  Bottom 0.406: JP2.12 48.9,92.71 49.53,92.08 57.15,92.08 57.78,91.44 TEMP_28.DQ2
B13  (via drill 0.6)
  Top 0.406: v62.87,90.17 62.23,90.81 52.07,90.81 51.44,91.44 JP2.13
  Bottom 0.406: TEMP_29.DQ2 v62.87,90.17
B14  (via drill 0.6)
  Top 0.406: v67.94,90.17 67.94,90.81 67.31,91.44 54.61,91.44 53.98,92.08 JP2.14
  Bottom 0.406: TEMP_30.DQ2 v67.94,90.17
B15  (via drill 0.6)
  Top 0.406: v73.03,90.17 73.03,91.44 72.39,92.08 57.15,92.08 56.52,92.71 JP2.15
  Bottom 0.406: TEMP_31.DQ2 v73.03,90.17
B16
  Bottom 0.406: JP2.16 59.69,92.71 75.56,92.71 78.11,90.17 TEMP_32.DQ2
C1
  Bottom 0.406: JP3.1 20.32,33.02 4.45,33.02 1.91,35.56 TEMP_33.DQ1
C2  (via drill 0.6)
  Top 0.406: JP3.2 23.5,33.02 22.86,33.66 7.62,33.66 6.99,34.29 v6.99,35.56
  Bottom 0.406: v6.99,35.56 TEMP_34.DQ1
C3  (via drill 0.6)
  Top 0.406: JP3.3 26.04,33.66 25.4,34.29 12.7,34.29 12.06,34.92 v12.06,35.56
  Bottom 0.406: v12.06,35.56 TEMP_35.DQ1
C4  (via drill 0.6)
  Top 0.406: JP3.4 28.57,34.29 27.94,34.92 17.78,34.92 v17.14,35.56
  Bottom 0.406: v17.14,35.56 TEMP_36.DQ1
C5
  Bottom 0.406: JP3.5 31.11,33.02 30.48,33.66 22.86,33.66 22.23,34.29 TEMP_37.DQ1
C6
  Bottom 0.406: JP3.6 33.66,33.66 33.02,34.29 27.94,34.29 27.3,34.92 TEMP_38.DQ1
C7
  Bottom 0.406: JP3.7 36.2,34.29 35.56,34.92 33.02,34.92 32.38,35.56 TEMP_39.DQ1
C8
  Bottom 0.406: JP3.8 38.73,34.29 37.47,35.56 TEMP_40.DQ1
C9
  Bottom 0.406: JP3.9 41.27,34.29 42.55,35.56 TEMP_41.DQ1
C10
  Bottom 0.406: JP3.10 43.81,34.29 44.45,34.92 46.99,34.92 47.62,35.56 TEMP_42.DQ1
C11
  Bottom 0.406: JP3.11 46.35,33.66 46.99,34.29 52.07,34.29 52.7,34.92 TEMP_43.DQ1
C12
  Bottom 0.406: JP3.12 48.9,33.02 49.53,33.66 57.15,33.66 57.78,34.29 TEMP_44.DQ1
C13  (via drill 0.6)
  Top 0.406: v62.87,35.56 62.23,34.92 52.07,34.92 51.44,34.29 JP3.13
  Bottom 0.406: v62.87,35.56 TEMP_45.DQ1
C14  (via drill 0.6)
  Top 0.406: JP3.14 53.98,33.66 54.61,34.29 67.31,34.29 67.94,34.92 v67.94,35.56
  Bottom 0.406: v67.94,35.56 TEMP_46.DQ1
C15  (via drill 0.6)
  Top 0.406: v73.03,35.56 73.03,34.29 72.39,33.66 57.15,33.66 56.52,33.02 JP3.15
  Bottom 0.406: v73.03,35.56 TEMP_47.DQ1
C16
  Bottom 0.406: JP3.16 59.69,33.02 75.56,33.02 78.11,35.56 TEMP_48.DQ1
D1
  Bottom 0.406: JP4.1 20.32,29.21 4.45,29.21 1.91,26.67 TEMP_49.DQ2
D2  (via drill 0.6)
  Top 0.406: JP4.2 23.5,29.21 22.86,28.57 7.62,28.57 6.99,27.94 v6.99,26.67
  Bottom 0.406: TEMP_50.DQ2 v6.99,26.67
D3  (via drill 0.6)
  Top 0.406: JP4.3 26.04,28.57 25.4,27.94 12.7,27.94 12.06,27.3 v12.06,26.67
  Bottom 0.406: TEMP_51.DQ2 v12.06,26.67
D4  (via drill 0.6)
  Top 0.406: v17.14,26.67 17.78,27.3 27.94,27.3 28.57,27.94 JP4.4
  Bottom 0.406: TEMP_52.DQ2 v17.14,26.67
D5
  Bottom 0.406: JP4.5 31.11,29.21 30.48,28.57 22.86,28.57 22.23,27.94 TEMP_53.DQ2
D6
  Bottom 0.406: JP4.6 33.66,28.57 33.02,27.94 27.94,27.94 27.3,27.3 TEMP_54.DQ2
D7
  Bottom 0.406: JP4.7 36.2,27.94 35.56,27.3 33.02,27.3 32.38,26.67 TEMP_55.DQ2
D8
  Bottom 0.406: JP4.8 38.73,27.94 37.47,26.67 TEMP_56.DQ2
D9
  Bottom 0.406: JP4.9 41.27,27.94 42.55,26.67 TEMP_57.DQ2
D10
  Bottom 0.406: JP4.10 43.81,27.94 44.45,27.3 46.99,27.3 47.62,26.67 TEMP_58.DQ2
D11
  Bottom 0.406: JP4.11 46.35,28.57 46.99,27.94 52.07,27.94 52.7,27.3 TEMP_59.DQ2
D12
  Bottom 0.406: JP4.12 48.9,29.21 49.53,28.57 57.15,28.57 57.78,27.94 TEMP_60.DQ2
D13  (via drill 0.6)
  Top 0.406: v62.87,26.67 62.23,27.3 52.07,27.3 51.44,27.94 JP4.13
  Bottom 0.406: TEMP_61.DQ2 v62.87,26.67
D14  (via drill 0.6)
  Top 0.406: JP4.14 53.98,28.57 54.61,27.94 67.31,27.94 67.94,27.3 v67.94,26.67
  Bottom 0.406: TEMP_62.DQ2 v67.94,26.67
D15  (via drill 0.6)
  Top 0.406: JP4.15 56.52,29.21 57.15,28.57 72.39,28.57 73.03,27.94 v73.03,26.67
  Bottom 0.406: TEMP_63.DQ2 v73.03,26.67
D16
  Bottom 0.406: JP4.16 59.69,29.21 75.56,29.21 78.11,26.67 TEMP_64.DQ2
GND
  Top 0.406: TEMP_17.GND2 J1.1 J1.2 TEMP_1.GND1 TEMP_2.GND1 TEMP_3.GND1 TEMP_4.GND1 TEMP_5.GND1 TEMP_6.GND1 TEMP_7.GND1 TEMP_8.GND1 TEMP_9.GND1 TEMP_10.GND1 TEMP_11.GND1 TEMP_12.GND1 TEMP_13.GND1 TEMP_14.GND1 TEMP_15.GND1 TEMP_16.GND1 J2.2 J2.1 TEMP_32.GND2 | TEMP_64.GND2 J4.1 78.11,31.75 J4.2 TEMP_48.GND1 TEMP_47.GND1 TEMP_46.GND1 TEMP_45.GND1 TEMP_44.GND1 TEMP_43.GND1 TEMP_42.GND1 TEMP_41.GND1 TEMP_40.GND1 TEMP_39.GND1 TEMP_38.GND1 TEMP_37.GND1 TEMP_36.GND1 TEMP_35.GND1 TEMP_34.GND1 TEMP_33.GND1 J3.2 J3.1 TEMP_49.GND2 | TEMP_49.GND1 TEMP_50.GND1 TEMP_51.GND1 TEMP_52.GND1 TEMP_53.GND1 TEMP_54.GND1 TEMP_55.GND1 TEMP_56.GND1 TEMP_57.GND1 TEMP_58.GND1 TEMP_59.GND1 TEMP_60.GND1 TEMP_61.GND1 TEMP_62.GND1 TEMP_63.GND1 TEMP_64.GND1 | TEMP_33.GND2 TEMP_17.GND1 TEMP_18.GND1 TEMP_19.GND1 TEMP_20.GND1 TEMP_21.GND1 TEMP_22.GND1 TEMP_23.GND1 TEMP_24.GND1 TEMP_25.GND1 TEMP_26.GND1 TEMP_27.GND1 TEMP_28.GND1 TEMP_29.GND1 TEMP_30.GND1 TEMP_31.GND1 TEMP_32.GND1 TEMP_48.GND2

### Text on the board
tNames: 1 | 16 | GND | GND | 17 | 32 | Temperature board v4.0 | 33 | 48 | GND | GND | 49 | 64 | (c) john.hulth@geo.uio.no